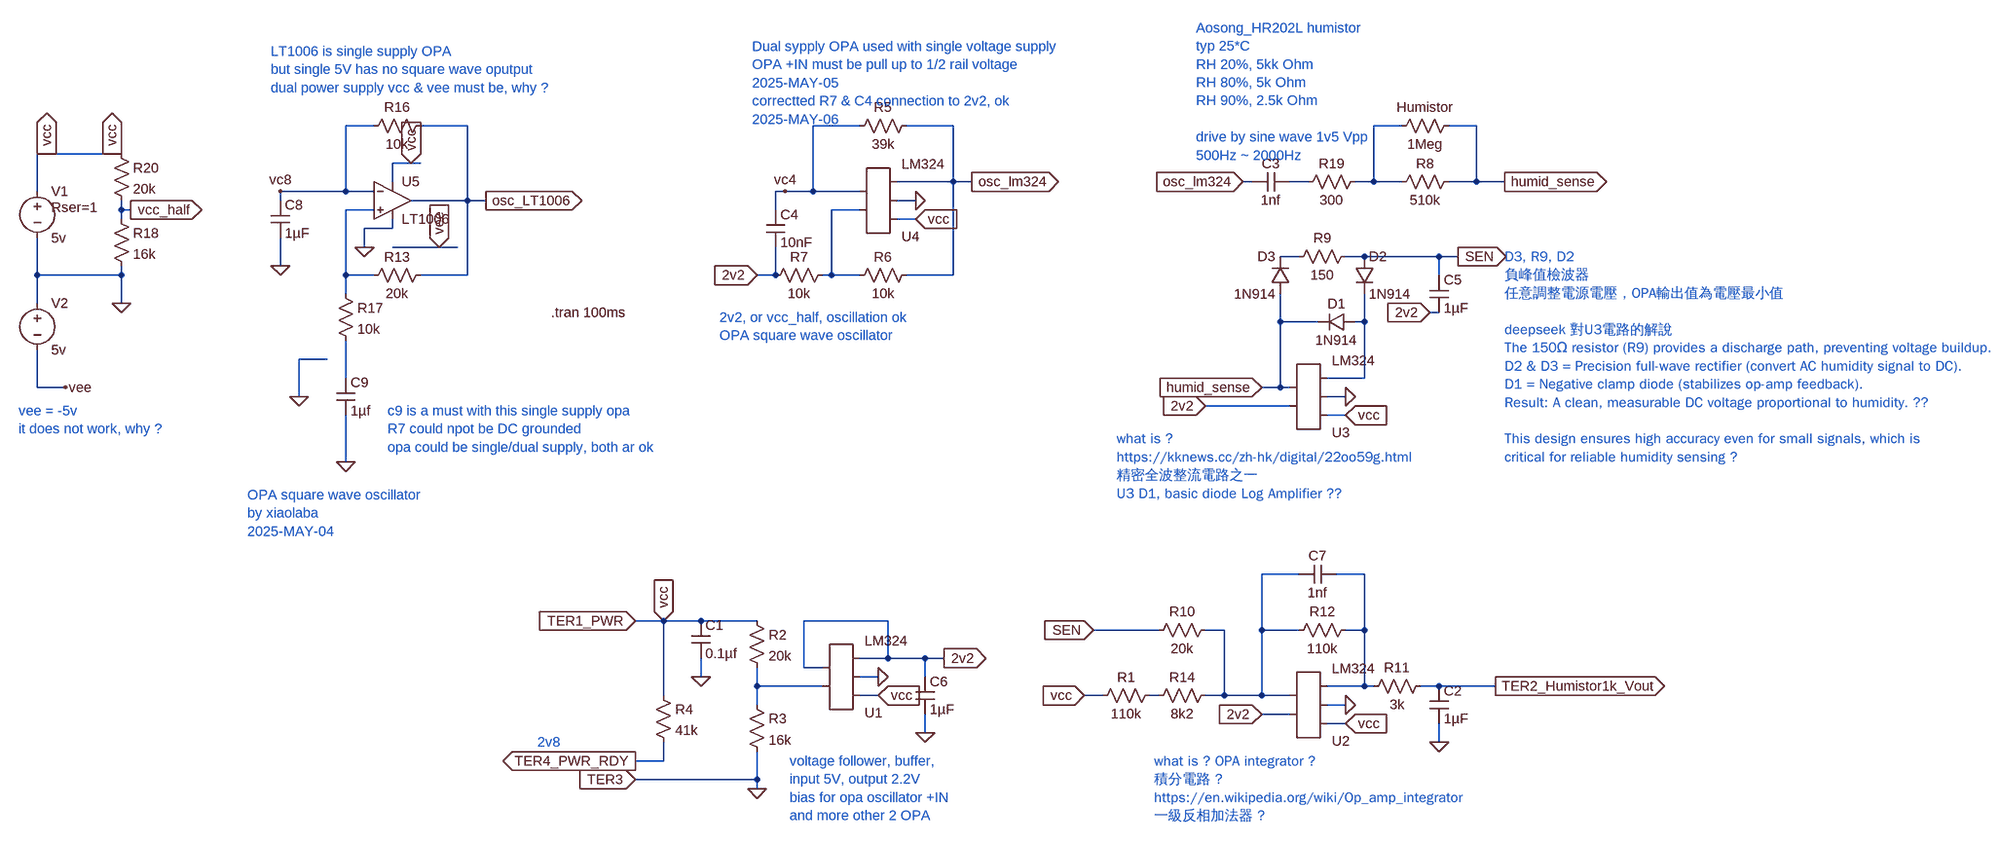
[diagram p0: schematic humidity_sensor.asc]
humidity_sensor.asc, the LTspice schematic file:
Version 4
SHEET 1 1868 972
WIRE -976 -224 -1024 -224
WIRE -816 -224 -896 -224
WIRE -144 -224 -224 -224
WIRE 16 -224 -64 -224
WIRE 784 -224 736 -224
WIRE 912 -224 864 -224
WIRE -1536 -176 -1552 -176
WIRE -1424 -176 -1536 -176
WIRE -1408 -176 -1424 -176
WIRE -912 -160 -944 -160
WIRE -896 -160 -912 -160
WIRE -944 -128 -944 -160
WIRE 16 -128 16 -224
WIRE 16 -128 -80 -128
WIRE 48 -128 16 -128
WIRE 528 -128 512 -128
WIRE 624 -128 592 -128
WIRE 736 -128 736 -224
WIRE 736 -128 704 -128
WIRE 784 -128 736 -128
WIRE 912 -128 912 -224
WIRE 912 -128 864 -128
WIRE 960 -128 912 -128
WIRE -1552 -112 -1552 -176
WIRE -1024 -112 -1024 -224
WIRE -1024 -112 -1136 -112
WIRE -976 -112 -1024 -112
WIRE -272 -112 -288 -112
WIRE -224 -112 -224 -224
WIRE -224 -112 -272 -112
WIRE -144 -112 -224 -112
WIRE -1136 -96 -1136 -112
WIRE -816 -96 -816 -224
WIRE -816 -96 -912 -96
WIRE -784 -96 -816 -96
WIRE -48 -96 -80 -96
WIRE -1408 -80 -1408 -96
WIRE -1392 -80 -1408 -80
WIRE -976 -80 -1024 -80
WIRE -288 -80 -288 -112
WIRE -144 -80 -192 -80
WIRE -1408 -64 -1408 -80
WIRE -48 -64 -80 -64
WIRE -944 -48 -944 -64
WIRE -944 -48 -992 -48
WIRE -992 -16 -992 -48
WIRE -864 -16 -944 -16
WIRE -832 -16 -864 -16
WIRE 608 0 576 0
WIRE 720 0 688 0
WIRE 848 0 720 0
WIRE 880 0 848 0
WIRE -1136 16 -1136 -32
WIRE -1552 32 -1552 -32
WIRE -1408 32 -1408 16
WIRE -1408 32 -1552 32
WIRE -1024 32 -1024 -80
WIRE -976 32 -1024 32
WIRE -816 32 -816 -96
WIRE -816 32 -896 32
WIRE -288 32 -288 -16
WIRE -288 32 -320 32
WIRE -192 32 -192 -80
WIRE -192 32 -208 32
WIRE -144 32 -192 32
WIRE 16 32 16 -128
WIRE 16 32 -64 32
WIRE 848 32 848 0
WIRE -1024 64 -1024 32
WIRE -1552 80 -1552 32
WIRE -1408 80 -1408 32
WIRE 848 96 832 96
WIRE 576 112 576 64
WIRE 640 112 576 112
WIRE 720 112 720 64
WIRE 720 112 704 112
WIRE -1056 176 -1104 176
WIRE -1024 208 -1024 144
WIRE 720 208 720 112
WIRE 720 208 656 208
WIRE -1552 224 -1552 160
WIRE -1504 224 -1552 224
WIRE 576 224 576 112
WIRE 576 224 544 224
WIRE 592 224 576 224
WIRE -1104 240 -1104 176
WIRE 688 240 656 240
WIRE 592 256 448 256
WIRE 688 272 656 272
WIRE -1024 352 -1024 272
WIRE 608 544 544 544
WIRE 720 544 672 544
WIRE -480 624 -528 624
WIRE -416 624 -480 624
WIRE -320 624 -416 624
WIRE -96 624 -240 624
WIRE 368 640 256 640
WIRE 480 640 448 640
WIRE 544 640 544 544
WIRE 608 640 544 640
WIRE 720 640 720 544
WIRE 720 640 688 640
WIRE -96 688 -96 624
WIRE -96 688 -144 688
WIRE -32 688 -96 688
WIRE 0 688 -32 688
WIRE -240 704 -240 624
WIRE -208 704 -240 704
WIRE -416 720 -416 688
WIRE -112 720 -144 720
WIRE -32 720 -32 688
WIRE -320 736 -320 704
WIRE -208 736 -320 736
WIRE 720 736 720 640
WIRE 720 736 656 736
WIRE 736 736 720 736
WIRE 848 736 816 736
WIRE 944 736 848 736
WIRE -480 752 -480 624
WIRE -112 752 -144 752
WIRE 272 752 240 752
WIRE 368 752 352 752
WIRE 480 752 480 640
WIRE 480 752 448 752
WIRE 544 752 544 640
WIRE 544 752 480 752
WIRE 592 752 544 752
WIRE -320 768 -320 736
WIRE 688 768 656 768
WIRE 592 784 544 784
WIRE 688 800 656 800
WIRE -32 816 -32 784
WIRE 848 832 848 800
WIRE -480 864 -480 832
WIRE -480 864 -528 864
WIRE -320 896 -320 848
WIRE -320 896 -528 896
WIRE -320 912 -320 896
FLAG -912 -160 vcc
IOPIN -912 -160 In
FLAG -1536 -176 vcc
IOPIN -1536 -176 Out
FLAG -32 816 0
FLAG -320 912 0
FLAG -480 624 vcc
IOPIN -480 624 In
FLAG 240 752 vcc
IOPIN 240 752 In
FLAG 848 832 0
FLAG 944 736 TER2_Humistor1k_Vout
IOPIN 944 736 Out
FLAG -416 720 0
FLAG -528 624 TER1_PWR
IOPIN -528 624 In
FLAG -528 864 TER4_PWR_RDY
IOPIN -528 864 Out
FLAG -528 896 TER3
IOPIN -528 896 In
FLAG -1024 352 0
FLAG -1136 16 0
FLAG -1504 224 vee
FLAG -992 -16 0
FLAG -864 -16 vee
IOPIN -864 -16 In
FLAG -784 -96 osc_LT1006
IOPIN -784 -96 Out
FLAG 48 -128 osc_lm324
IOPIN 48 -128 Out
FLAG -1408 80 0
FLAG 0 688 2v2
IOPIN 0 688 Out
FLAG -1424 -176 vcc
IOPIN -1424 -176 Out
FLAG -48 -64 vcc
IOPIN -48 -64 In
FLAG -1392 -80 vcc_half
IOPIN -1392 -80 Out
FLAG -48 -96 0
FLAG -272 -112 vc4
FLAG -1136 -112 vc8
FLAG -1104 240 0
FLAG -320 32 2v2
IOPIN -320 32 In
FLAG -112 752 vcc
IOPIN -112 752 In
FLAG -112 720 0
FLAG 688 272 vcc
IOPIN 688 272 In
FLAG 688 240 0
FLAG 688 800 vcc
IOPIN 688 800 In
FLAG 688 768 0
FLAG 544 784 2v2
IOPIN 544 784 In
FLAG 448 256 2v2
IOPIN 448 256 In
FLAG 512 -128 osc_lm324
IOPIN 512 -128 In
FLAG 960 -128 humid_sense
IOPIN 960 -128 Out
FLAG 544 224 humid_sense
IOPIN 544 224 In
FLAG 880 0 SEN
IOPIN 880 0 Out
FLAG 256 640 SEN
IOPIN 256 640 In
FLAG 832 96 2v2
IOPIN 832 96 In
SYMBOL res -880 16 R90
WINDOW 0 0 56 VBottom 2
WINDOW 3 32 56 VTop 2
SYMATTR InstName R13
SYMATTR Value 20k
SYMBOL res -880 -240 R90
WINDOW 0 0 56 VBottom 2
WINDOW 3 32 56 VTop 2
SYMATTR InstName R16
SYMATTR Value 10k
SYMBOL voltage -1552 -128 R0
WINDOW 123 0 0 Left 0
WINDOW 39 24 44 Left 2
SYMATTR SpiceLine Rser=1
SYMATTR InstName V1
SYMATTR Value 5v
SYMBOL diode 704 0 R0
SYMATTR InstName D2
SYMATTR Value 1N914
SYMBOL diode 592 64 R180
WINDOW 0 24 64 Left 2
WINDOW 3 24 0 Left 2
SYMATTR InstName D3
SYMATTR Value 1N914
SYMBOL diode 704 96 R90
WINDOW 0 0 32 VBottom 2
WINDOW 3 32 32 VTop 2
SYMATTR InstName D1
SYMATTR Value 1N914
SYMBOL res 704 -16 R90
WINDOW 0 0 56 VBottom 2
WINDOW 3 32 56 VTop 2
SYMATTR InstName R9
SYMATTR Value 150
SYMBOL cap 832 32 R0
SYMATTR InstName C5
SYMATTR Value 1µF
SYMBOL res -336 752 R0
SYMATTR InstName R3
SYMATTR Value 16k
SYMBOL res -336 608 R0
SYMATTR InstName R2
SYMATTR Value 20k
SYMBOL cap -48 720 R0
SYMATTR InstName C6
SYMATTR Value 1µF
SYMBOL cap -432 624 R0
SYMATTR InstName C1
SYMATTR Value 0.1µf
SYMBOL res 352 768 R270
WINDOW 0 32 56 VTop 2
WINDOW 3 0 56 VBottom 2
SYMATTR InstName R14
SYMATTR Value 8k2
SYMBOL res 256 768 R270
WINDOW 0 32 56 VTop 2
WINDOW 3 0 56 VBottom 2
SYMATTR InstName R1
SYMATTR Value 110k
SYMBOL res 352 656 R270
WINDOW 0 32 56 VTop 2
WINDOW 3 0 56 VBottom 2
SYMATTR InstName R10
SYMATTR Value 20k
SYMBOL res 832 720 R90
WINDOW 0 0 56 VBottom 2
WINDOW 3 32 56 VTop 2
SYMATTR InstName R11
SYMATTR Value 3k
SYMBOL res 704 624 R90
WINDOW 0 0 56 VBottom 2
WINDOW 3 32 56 VTop 2
SYMATTR InstName R12
SYMATTR Value 110k
SYMBOL cap 672 528 R90
WINDOW 0 0 32 VBottom 2
WINDOW 3 32 32 VTop 2
SYMATTR InstName C7
SYMATTR Value 1nf
SYMBOL cap 832 736 R0
SYMATTR InstName C2
SYMATTR Value 1µF
SYMBOL res -496 736 R0
SYMATTR InstName R4
SYMATTR Value 41k
SYMBOL cap 592 -144 R90
WINDOW 0 0 32 VBottom 2
WINDOW 3 32 32 VTop 2
SYMATTR InstName C3
SYMATTR Value 1nf
SYMBOL res 720 -144 R90
WINDOW 0 0 56 VBottom 2
WINDOW 3 32 56 VTop 2
SYMATTR InstName R19
SYMATTR Value 300
SYMBOL res 768 -112 R270
WINDOW 0 32 56 VTop 2
WINDOW 3 0 56 VBottom 2
SYMATTR InstName R8
SYMATTR Value 510k
SYMBOL res 768 -208 R270
WINDOW 0 32 56 VTop 2
WINDOW 3 0 56 VBottom 2
SYMATTR InstName Humistor
SYMATTR Value 1Meg
SYMBOL res -1040 48 R0
SYMATTR InstName R17
SYMATTR Value 10k
SYMBOL cap -1152 -96 R0
SYMATTR InstName C8
SYMATTR Value 1µF
SYMBOL voltage -1552 64 R0
WINDOW 123 0 0 Left 0
WINDOW 39 0 0 Left 0
SYMATTR InstName V2
SYMATTR Value 5v
SYMBOL Opamps\\LT1006 -944 -160 R0
SYMATTR InstName U5
SYMBOL res -48 16 R90
WINDOW 0 0 56 VBottom 2
WINDOW 3 32 56 VTop 2
SYMATTR InstName R6
SYMATTR Value 10k
SYMBOL res -48 -240 R90
WINDOW 0 0 56 VBottom 2
WINDOW 3 32 56 VTop 2
SYMATTR InstName R5
SYMATTR Value 39k
SYMBOL res -192 16 R90
WINDOW 0 0 56 VBottom 2
WINDOW 3 32 56 VTop 2
SYMATTR InstName R7
SYMATTR Value 10k
SYMBOL cap -304 -80 R0
SYMATTR InstName C4
SYMATTR Value 10nF
SYMBOL res -1424 -80 R0
SYMATTR InstName R18
SYMATTR Value 16k
SYMBOL res -1424 -192 R0
SYMATTR InstName R20
SYMATTR Value 20k
SYMBOL cap -1040 208 R0
SYMATTR InstName C9
SYMATTR Value 1µf
SYMBOL AutoGenerated\\LM324 -112 -96 M180
SYMATTR InstName U4
SYMBOL AutoGenerated\\LM324 -176 720 M180
SYMATTR InstName U1
SYMBOL AutoGenerated\\LM324 624 240 M180
SYMATTR InstName U3
SYMBOL AutoGenerated\\LM324 624 768 M180
SYMATTR InstName U2
TEXT -672 96 Left 2 !.tran 100ms
TEXT -1192 408 Left 2 ;OPA square wave oscillator\nby xiaolaba\n2025-MAY-04
TEXT -1152 -352 Left 2 ;LT1006 is single supply OPA\nbut single 5V has no square wave oputput\ndual power supply vcc & vee must be, why ?
TEXT -328 -360 Left 2 ;Dual sypply OPA used with single voltage supply\nOPA +IN must be pull up to 1/2 rail voltage\n2025-MAY-05\ncorrectted R7 & C4 connection to 2v2, ok\n2025-MAY-06
TEXT -264 864 Left 2 ;voltage follower, buffer,\ninput 5V, output 2.2V\nbias for opa oscillator +IN\nand more other 2 OPA
TEXT -952 264 Left 2 ;c9 is a must with this single supply opa\nR7 could npot be DC grounded\nopa could be single/dual supply, both ar ok
TEXT -1584 264 Left 2 ;vee = -5v\nit does not work, why ?
TEXT -384 104 Left 2 ;2v2, or vcc_half, oscillation ok\nOPA square wave oscillator
TEXT 360 864 Left 2 ;what is ? OPA integrator ?\n積分電路 ?\nhttps://en.wikipedia.org/wiki/Op_amp_integrator\n一級反相加法器 ?
TEXT 296 312 Left 2 ;what is ?\nhttps://kknews.cc/zh-hk/digital/22oo59g.html\n精密全波整流電路之一\nU3 D1, basic diode Log Amplifier ??
TEXT -696 832 Left 2 ;2v8
TEXT 960 0 Left 2 ;D3, R9, D2\n負峰值檢波器\n任意調整電源電壓，OPA輸出值為電壓最小值\n \ndeepseek 對U3電路的解說\nThe 150Ω resistor (R9) provides a discharge path, preventing voltage buildup.\nD2 & D3 = Precision full-wave rectifier (convert AC humidity signal to DC).\nD1 = Negative clamp diode (stabilizes op-amp feedback).\nResult: A clean, measurable DC voltage proportional to humidity. ??\n \nThis design ensures high accuracy even for small signals, which is\ncritical for reliable humidity sensing ?
TEXT 432 -392 Left 2 ;Aosong_HR202L humistor\ntyp 25*C\nRH 20%, 5kk Ohm\nRH 80%, 5k Ohm\nRH 90%, 2.5k Ohm\n \ndrive by sine wave 1v5 Vpp\n500Hz ~ 2000Hz

The netlist it stands for:
* humidity_sensor.asc
R13 osc_LT1006 N003 20k
R16 osc_LT1006 vc8 10k
V1 TER1_PWR 0 5v Rser=1
D2 SEN N006 1N914
D3 humid_sense N005 1N914
D1 N006 humid_sense 1N914
R9 SEN N005 150
C5 SEN 2v2 1µF
R3 N010 0 16k
R2 TER1_PWR N010 20k
C6 2v2 0 1µF
C1 TER1_PWR 0 0.1µf
R14 N011 N008 8k2
R1 TER1_PWR N011 110k
R10 SEN N008 20k
R11 TER2_Humistor1k_Vout N009 3k
R12 N009 N008 110k
C7 N009 N008 1nf
C2 TER2_Humistor1k_Vout 0 1µF
R4 TER1_PWR TER4_PWR_RDY 41k
C3 N002 osc_lm324 1nf
R19 N001 N002 300
R8 N001 humid_sense 510k
R§Humistor N001 humid_sense 1Meg
R17 N003 N007 10k
C8 vc8 0 1µF
V2 0 vee 5v
XU5 N003 vc8 TER1_PWR 0 osc_LT1006 LT1006  ; pins In+ In- V+ V- OUT
R6 osc_lm324 N004 10k
R5 osc_lm324 vc4 39k
R7 N004 2v2 10k
C4 vc4 2v2 10nF
R18 vcc_half 0 16k
R20 TER1_PWR vcc_half 20k
C9 N007 0 1µf
* U4: LM324 (symbol AutoGenerated\LM324 not available, pins judged from their places): pin1=N004 pin2=vc4 pin3=TER1_PWR pin4=0 pin5=osc_lm324
* U1: LM324 (symbol AutoGenerated\LM324 not available, pins judged from their places): pin1=N010 pin2=2v2 pin3=TER1_PWR pin4=0 pin5=2v2
* U3: LM324 (symbol AutoGenerated\LM324 not available, pins judged from their places): pin1=2v2 pin2=humid_sense pin3=TER1_PWR pin4=0 pin5=N006
* U2: LM324 (symbol AutoGenerated\LM324 not available, pins judged from their places): pin1=2v2 pin2=N008 pin3=TER1_PWR pin4=0 pin5=N009
.model D D
.lib standard.dio
.tran 100ms
* OPA square wave oscillator
* by xiaolaba
* 2025-MAY-04
* LT1006 is single supply OPA
* but single 5V has no square wave oputput
* dual power supply vcc & vee must be, why ?
* Dual sypply OPA used with single voltage supply
* OPA +IN must be pull up to 1/2 rail voltage
* 2025-MAY-05
* correctted R7 & C4 connection to 2v2, ok
* 2025-MAY-06
* voltage follower, buffer,
* input 5V, output 2.2V
* bias for opa oscillator +IN
* and more other 2 OPA
* c9 is a must with this single supply opa
* R7 could npot be DC grounded
* opa could be single/dual supply, both ar ok
* vee = -5v
* it does not work, why ?
* 2v2, or vcc_half, oscillation ok
* OPA square wave oscillator
* what is ? OPA integrator ?
* 積分電路 ?
* https://en.wikipedia.org/wiki/Op_amp_integrator
* 一級反相加法器 ?
* what is ?
* https://kknews.cc/zh-hk/digital/22oo59g.html
* 精密全波整流電路之一
* U3 D1, basic diode Log Amplifier ??
* 2v8
* D3, R9, D2
* 負峰值檢波器
* 任意調整電源電壓，OPA輸出值為電壓最小值
* deepseek 對U3電路的解說
* The 150Ω resistor (R9) provides a discharge path, preventing voltage buildup.
* D2 & D3 = Precision full-wave rectifier (convert AC humidity signal to DC).
* D1 = Negative clamp diode (stabilizes op-amp feedback).
* Result: A clean, measurable DC voltage proportional to humidity. ??
* This design ensures high accuracy even for small signals, which is
* critical for reliable humidity sensing ?
* Aosong_HR202L humistor
* typ 25*C
* RH 20%, 5kk Ohm
* RH 80%, 5k Ohm
* RH 90%, 2.5k Ohm
* drive by sine wave 1v5 Vpp
* 500Hz ~ 2000Hz
.lib LTC.lib
.backanno
.end